# EAGLE schematic Front_Board_v6 (EAGLE 9.7.0)
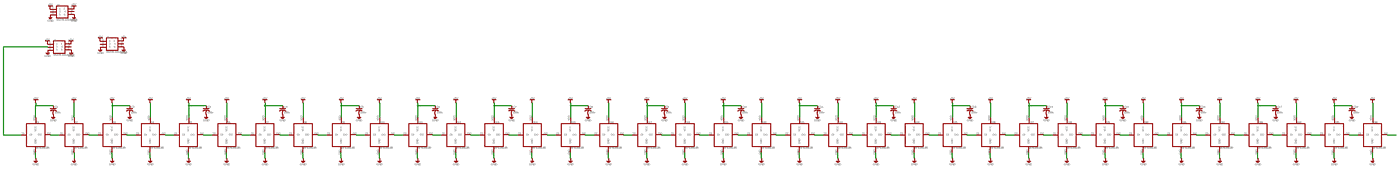
[diagram p0: schematic, sheet 1, overview]
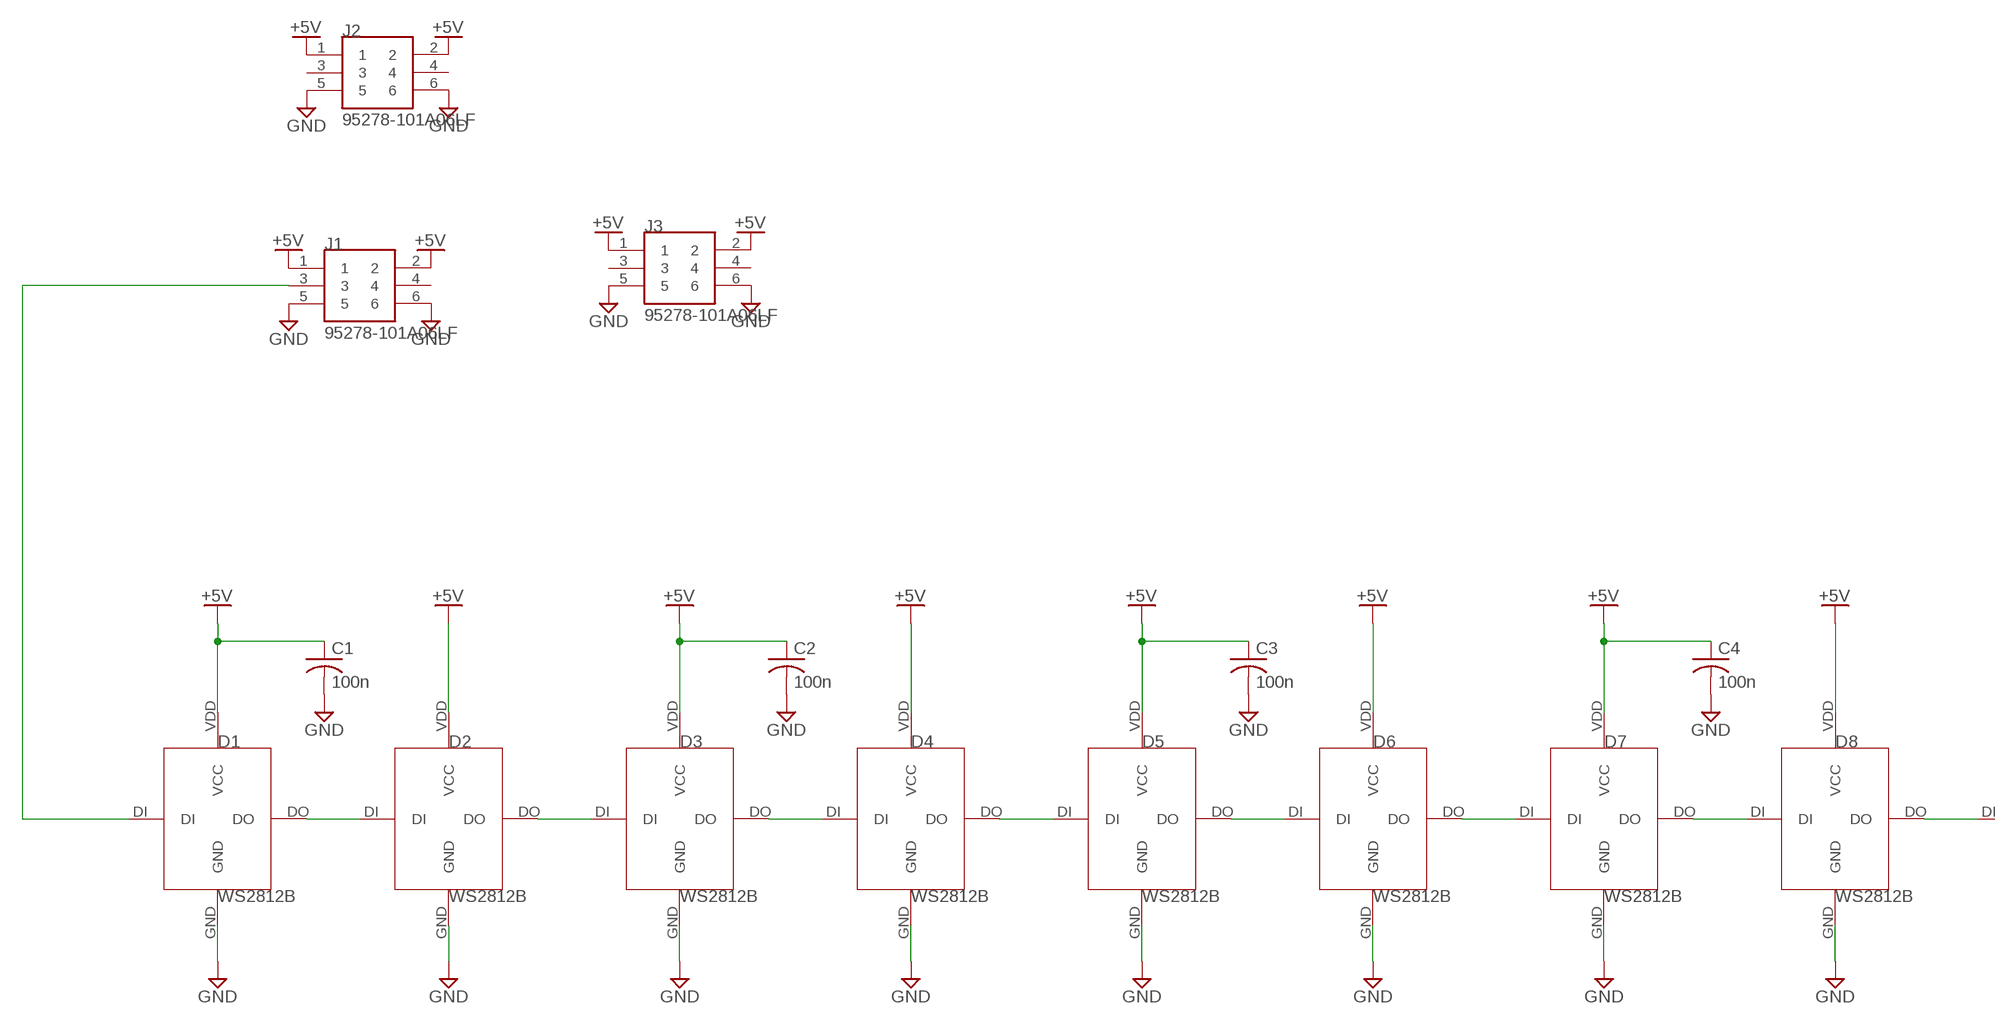
[diagram p1: schematic, sheet 1, part 1 of 4]
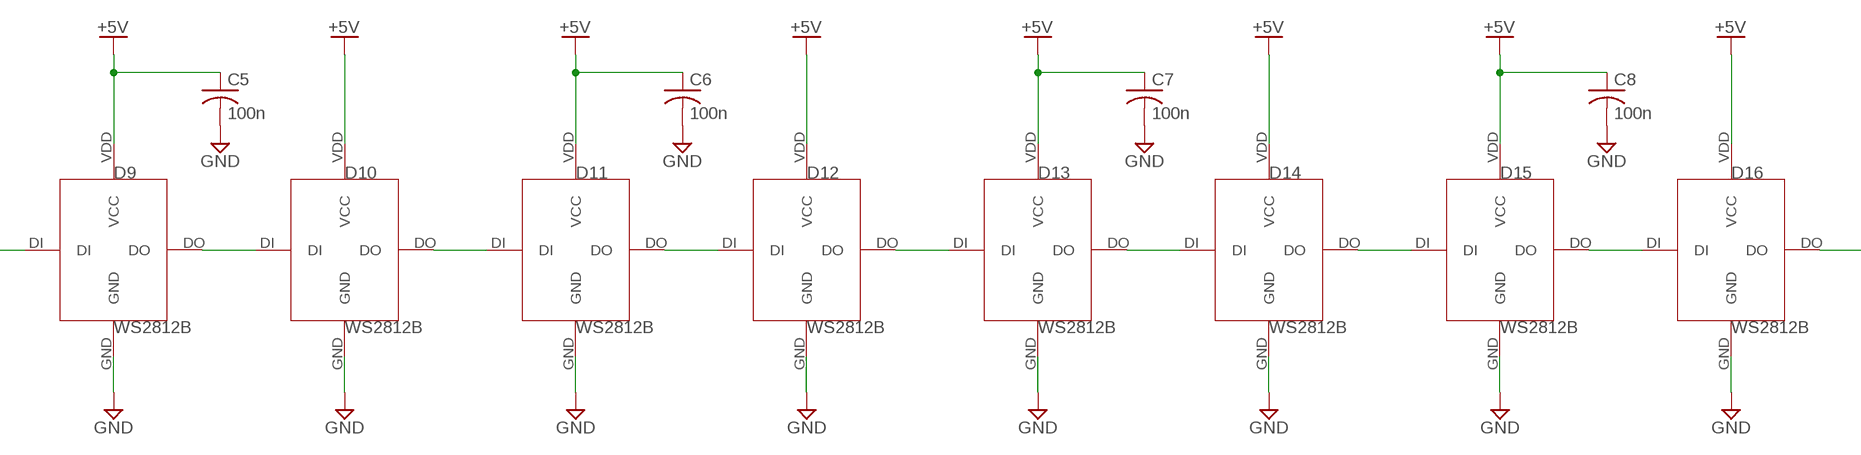
[diagram p2: schematic, sheet 1, part 2 of 4]
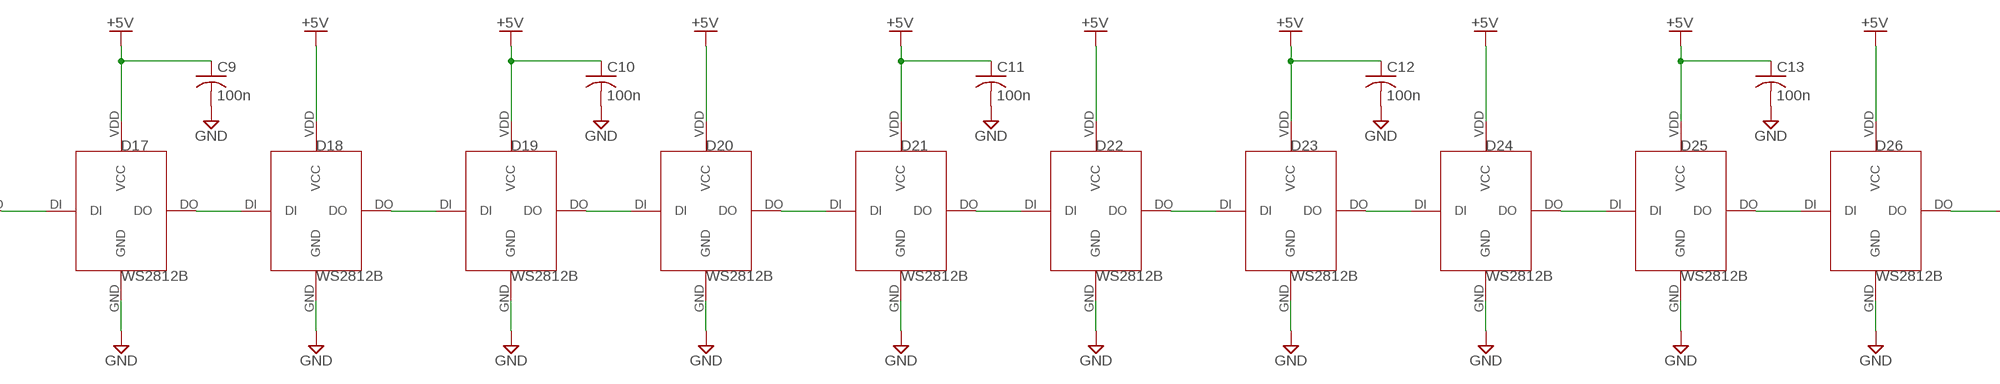
[diagram p3: schematic, sheet 1, part 3 of 4]
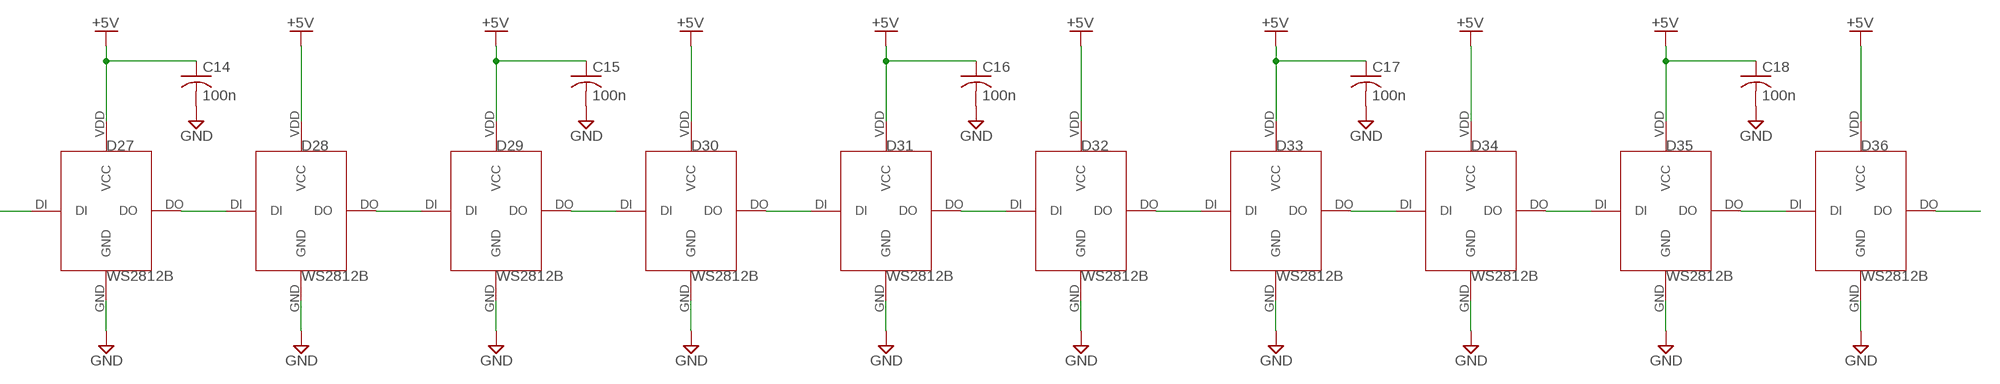
[diagram p4: schematic, sheet 1, part 4 of 4]

## Parts
C1  100n  C-USC0603K  [C0603K]
C2  100n  C-USC0603K  [C0603K]
C3  100n  C-USC0603K  [C0603K]
C4  100n  C-USC0603K  [C0603K]
C5  100n  C-USC0603K  [C0603K]
C6  100n  C-USC0603K  [C0603K]
C7  100n  C-USC0603K  [C0603K]
C8  100n  C-USC0603K  [C0603K]
C9  100n  C-USC0603K  [C0603K]
C10  100n  C-USC0603K  [C0603K]
C11  100n  C-USC0603K  [C0603K]
C12  100n  C-USC0603K  [C0603K]
C13  100n  C-USC0603K  [C0603K]
C14  100n  C-USC0603K  [C0603K]
C15  100n  C-USC0603K  [C0603K]
C16  100n  C-USC0603K  [C0603K]
C17  100n  C-USC0603K  [C0603K]
C18  100n  C-USC0603K  [C0603K]
D1  WS2812B  [1010]
D2  WS2812B  [1010]
D3  WS2812B  [1010]
D4  WS2812B  [1010]
D5  WS2812B  [1010]
D6  WS2812B  [1010]
D7  WS2812B  [1010]
D8  WS2812B  [1010]
D9  WS2812B  [1010]
D10  WS2812B  [1010]
D11  WS2812B  [1010]
D12  WS2812B  [1010]
D13  WS2812B  [1010]
D14  WS2812B  [1010]
D15  WS2812B  [1010]
D16  WS2812B  [1010]
D17  WS2812B  [1010]
D18  WS2812B  [1010]
D19  WS2812B  [1010]
D20  WS2812B  [1010]
D21  WS2812B  [1010]
D22  WS2812B  [1010]
D23  WS2812B  [1010]
D24  WS2812B  [1010]
D25  WS2812B  [1010]
D26  WS2812B  [1010]
D27  WS2812B  [1010]
D28  WS2812B  [1010]
D29  WS2812B  [1010]
D30  WS2812B  [1010]
D31  WS2812B  [1010]
D32  WS2812B  [1010]
D33  WS2812B  [1010]
D34  WS2812B  [1010]
D35  WS2812B  [1010]
D36  WS2812B  [1010]
J1  95278-101A06LF  [95278-101A06LF]
J2  95278-101A06LF  [95278-101A06LF]
J3  95278-101A06LF  [95278-101A06LF]

## Nets
+5V: C1.1 C2.1 C3.1 C4.1 C5.1 C6.1 C7.1 C8.1 C9.1 C10.1 C11.1 C12.1 C13.1 C14.1 C15.1 C16.1 C17.1 C18.1 D1.VDD(VCC) D2.VDD(VCC) D3.VDD(VCC) D4.VDD(VCC) D5.VDD(VCC) D6.VDD(VCC) D7.VDD(VCC) D8.VDD(VCC) D9.VDD(VCC) D10.VDD(VCC) D11.VDD(VCC) D12.VDD(VCC) D13.VDD(VCC) D14.VDD(VCC) D15.VDD(VCC) D16.VDD(VCC) D17.VDD(VCC) D18.VDD(VCC) D19.VDD(VCC) D20.VDD(VCC) D21.VDD(VCC) D22.VDD(VCC) D23.VDD(VCC) D24.VDD(VCC) D25.VDD(VCC) D26.VDD(VCC) D27.VDD(VCC) D28.VDD(VCC) D29.VDD(VCC) D30.VDD(VCC) D31.VDD(VCC) D32.VDD(VCC) D33.VDD(VCC) D34.VDD(VCC) D35.VDD(VCC) D36.VDD(VCC) J1.1 J1.2 J2.1 J2.2 J3.1 J3.2
GND: C1.2 C2.2 C3.2 C4.2 C5.2 C6.2 C7.2 C8.2 C9.2 C10.2 C11.2 C12.2 C13.2 C14.2 C15.2 C16.2 C17.2 C18.2 D1.GND D2.GND D3.GND D4.GND D5.GND D6.GND D7.GND D8.GND D9.GND D10.GND D11.GND D12.GND D13.GND D14.GND D15.GND D16.GND D17.GND D18.GND D19.GND D20.GND D21.GND D22.GND D23.GND D24.GND D25.GND D26.GND D27.GND D28.GND D29.GND D30.GND D31.GND D32.GND D33.GND D34.GND D35.GND D36.GND J1.5 J1.6 J2.5 J2.6 J3.5 J3.6
N$1: D1.DO D2.DI
N$2: D2.DO D3.DI
N$3: D3.DO D4.DI
N$4: D4.DO D5.DI
N$5: D5.DO D6.DI
N$6: D6.DO D7.DI
N$7: D7.DO D8.DI
N$8: D8.DO D9.DI
N$9: D9.DO D10.DI
N$10: D10.DO D11.DI
N$11: D11.DO D12.DI
N$12: D12.DO D13.DI
N$13: D13.DO D14.DI
N$14: D14.DO D15.DI
N$15: D15.DO D16.DI
N$16: D16.DO D17.DI
N$17: D17.DO D18.DI
N$18: D18.DO D19.DI
N$19: D19.DO D20.DI
N$20: D20.DO D21.DI
N$21: D21.DO D22.DI
N$22: D22.DO D23.DI
N$23: D23.DO D24.DI
N$24: D24.DO D25.DI
N$25: D25.DO D26.DI
N$26: D26.DO D27.DI
N$27: D27.DO D28.DI
N$28: D28.DO D29.DI
N$29: D29.DO D30.DI
N$30: D30.DO D31.DI
N$31: D31.DO D32.DI
N$32: D32.DO D33.DI
N$33: D1.DI J1.3
N$34: D33.DO D34.DI
N$35: D34.DO D35.DI
N$36: D35.DO D36.DI
N$37: D36.DO
Unconnected: J1.4 J2.3 J2.4 J3.3 J3.4

## Library data of the parts
C1-C18 = rcl:C-US: CAPACITOR, American symbol; SPICEPREFIX: C
D1-D36 = SnapEDA Library:WS2812B
J1-J3 = Connectors:95278-101A06LF: CONN HEADER SMD 6POS 2.54MM Manufacturer's datasheet <https://cdn.amphenol-icc.com/media/wysiwyg/files/drawing/95278.pdf>; CREATED_BY: PCBLayout.com; DIGIKEY_PART_NUMBER: 609-3487-1-ND; MANUFACTURER: Amphenol ICC (FCI); MPN: 95278-101A06LF